# Altium project Capacitive_Touch_Sensor.PrjPcb
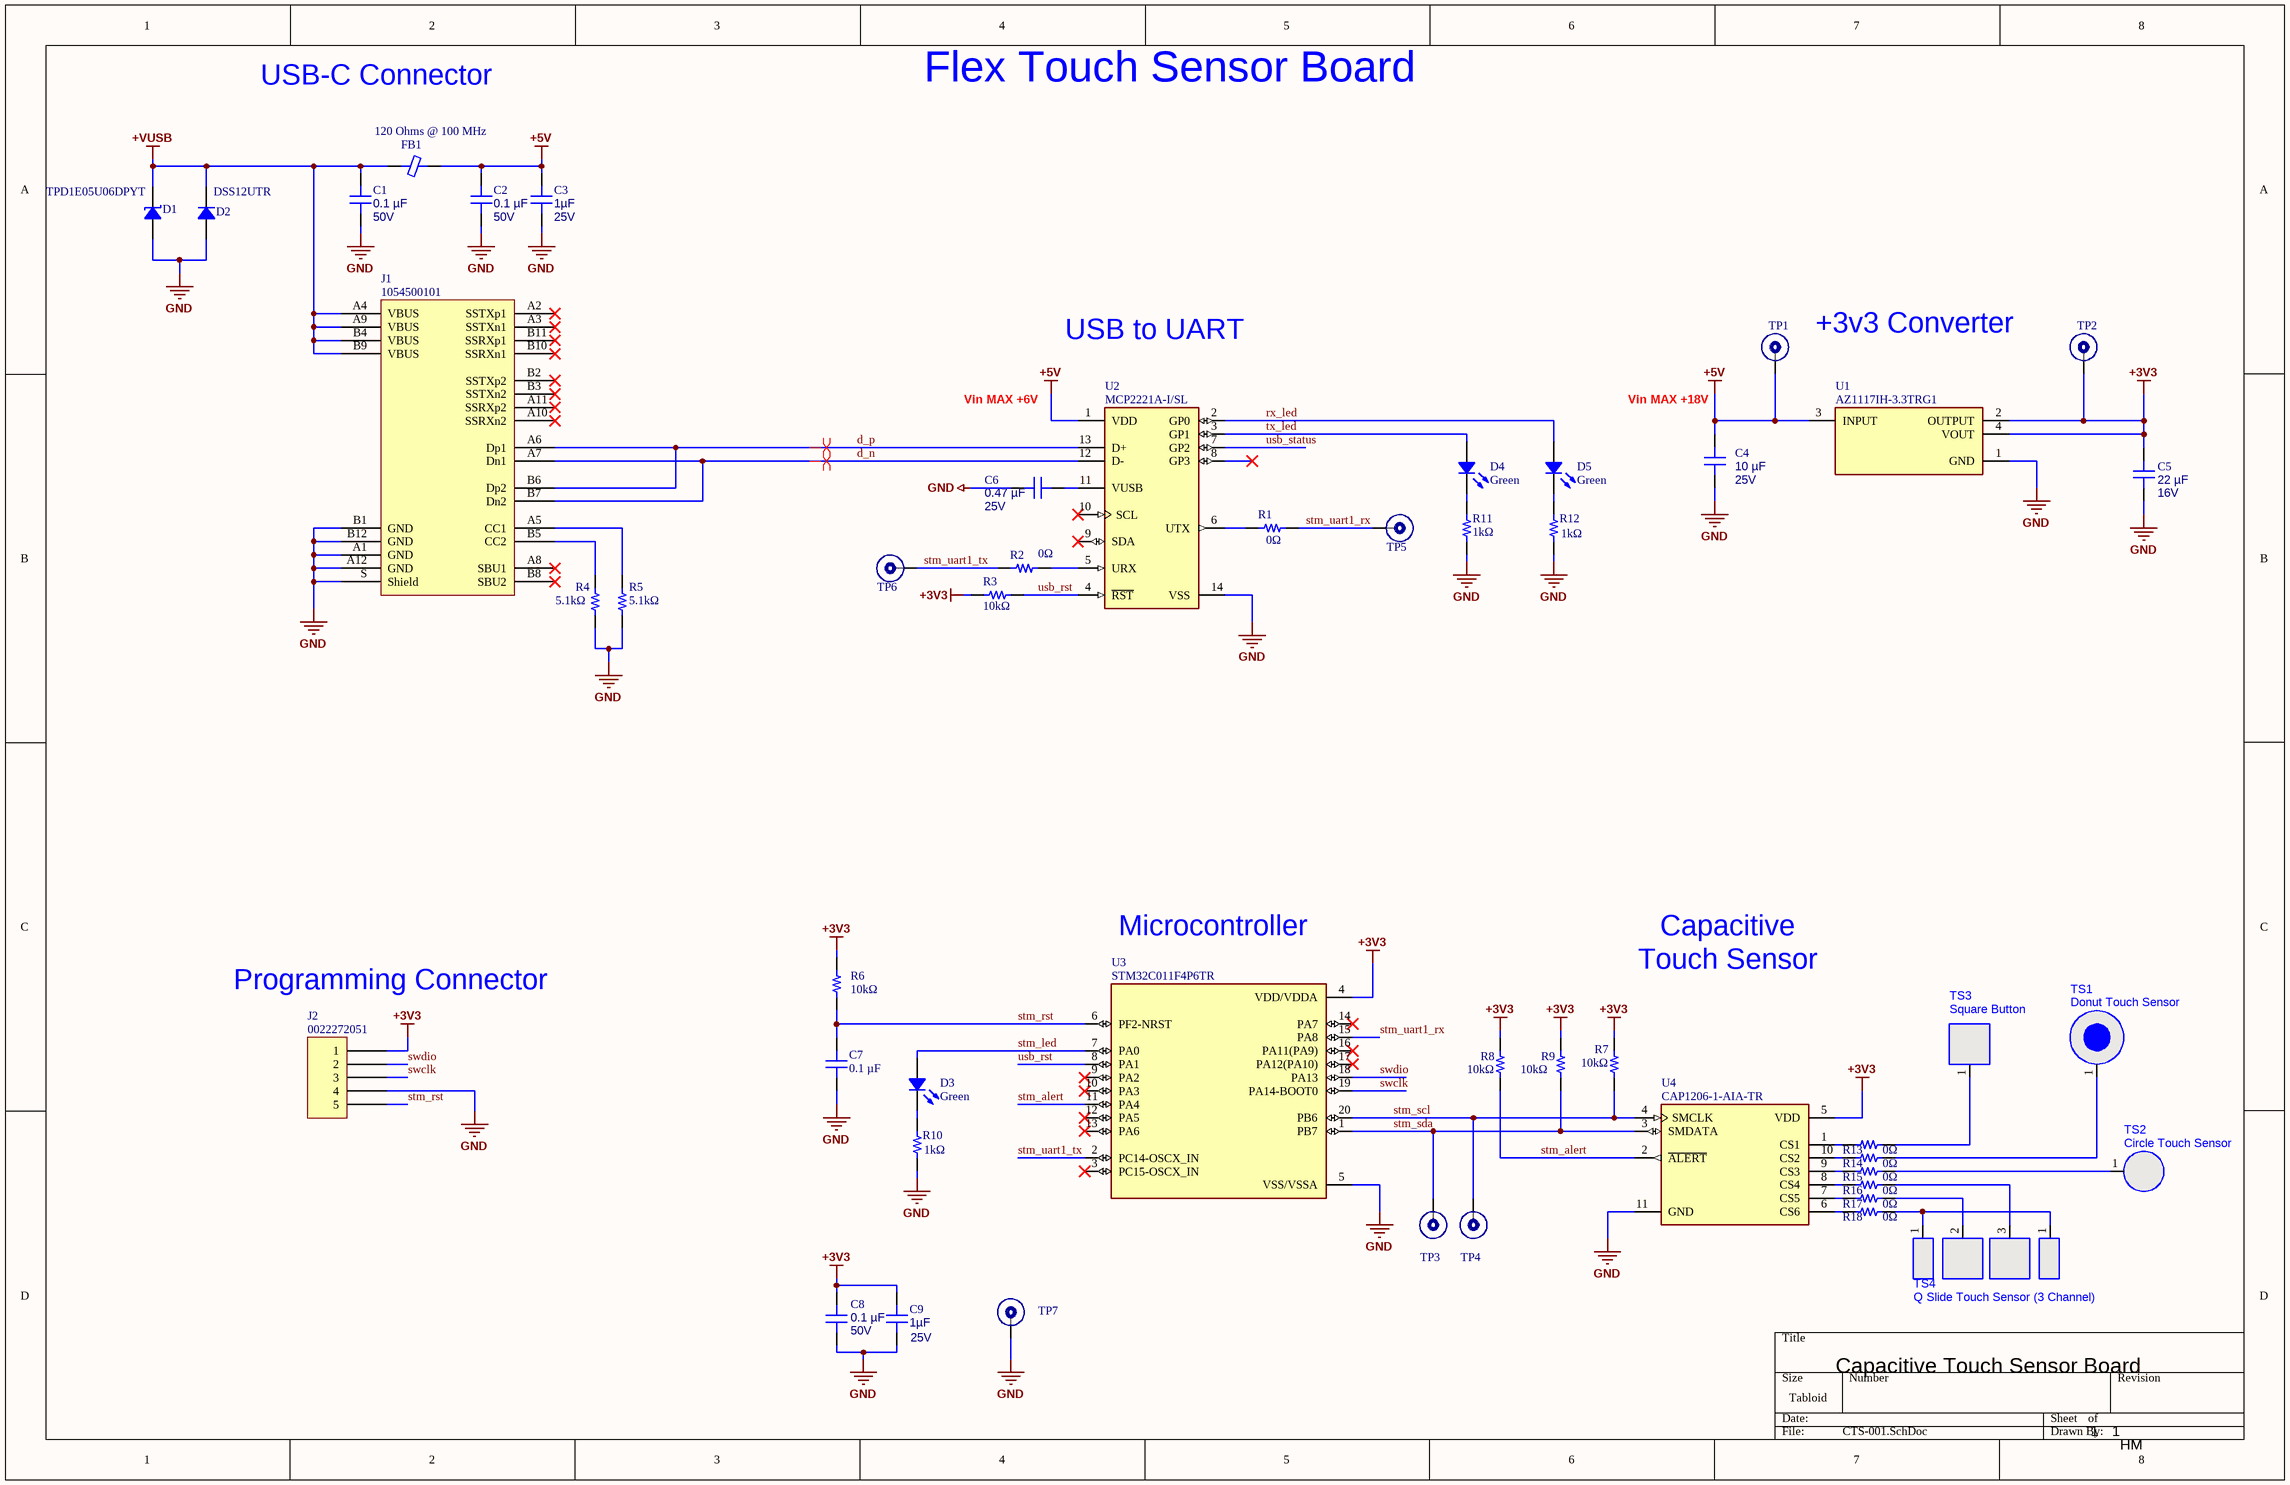
[diagram p0: CTS-001.SchDoc]
1 sheet, 50 parts. Net scope: global (net labels, ports and power ports of the same name join across sheets).
Board file: CTS.PcbDoc

## Sheet CTS-001.SchDoc
size Tabloid; SheetNumber: 1; SheetTotal: 1

### Parts
C1  Voltage - Rated: 50V  [CAP 0603_1608]  (hidden comment: 0.1 µF)
C2  Voltage - Rated: 50V  [CAP 0603_1608]  (hidden comment: 0.1 µF)
C3  Voltage - Rated: 25V  [CAP 0603_1608]  (hidden comment: 1µF)
C4  Voltage - Rated: 25V  [CAP 1206_3216 - 0.8MM]  (hidden comment: 10 µF)
C5  Voltage - Rated: 16V  [CAP 1206_3216 - 0.8MM]  (hidden comment: 22 µF)
C6  Voltage - Rated: 25V  [CAP 0603_1608]  (hidden comment: 0.47 µF)
C7  0.1 µF  [CAP 0603_1608]
C8  Voltage - Rated: 50V  [CAP 0603_1608]  (hidden comment: 0.1 µF)
C9  Voltage - Rated: 25V  [CAP 0603_1608]  (hidden comment: 1µF)
D1  TPD1E05U06DPYT  [0402]
D2  DSS12UTR  [SOD123F]
D3  Green  [LED 0603_1608 GREEN]
D4  Green  [LED 0603_1608 GREEN]
D5  Green  [LED 0603_1608 GREEN]
FB1  120 Ohms @ 100 MHz  [FER 0603_1608]
J1  1054500101  [Molex 1054500101]
J2  0022272051  [MOLEX KK 0022272051]
R1  0Ω  [RES 0805_2012]
R2  0Ω  [RES 0805_2012]
R3  10kΩ  [RES 0603_1608]
R4  5.1kΩ  [RES 0603_1608]
R5  5.1kΩ  [RES 0603_1608]
R6  10kΩ  [RES 0603_1608]
R7  10kΩ  [RES 0603_1608]
R8  10kΩ  [RES 0603_1608]
R9  10kΩ  [RES 0603_1608]
R10  1kΩ  [RES 0603_1608]
R11  1kΩ  [RES 0603_1608]
R12  1kΩ  [RES 0603_1608]
R13  0Ω  [RES 0805_2012]
R14  0Ω  [RES 0805_2012]
R15  0Ω  [RES 0805_2012]
R16  0Ω  [RES 0805_2012]
R17  0Ω  [RES 0805_2012]
R18  0Ω  [RES 0805_2012]
TP1  Test Point  [Compact]  (value not drawn)
TP2  Test Point  [Compact]  (value not drawn)
TP3  Test Point  [Compact]  (value not drawn)
TP4  Test Point  [Compact]  (value not drawn)
TP5  Test Point  [Compact]  (value not drawn)
TP6  Test Point  [Compact]  (value not drawn)
TP7  Test Point  [Compact]  (value not drawn)
TS1  Donut Touch Sensor  [DONUT TOUCH SENSOR]
TS2  Circle Touch Sensor  [CIRCLE TOUCH SENSOR]
TS3  Square Button  [Square Touch Sensor]
TS4  Q Slide Touch Sensor (3 Channel)  [Q TOUCH SLIDE SENSOR]
U1  AZ1117IH-3.3TRG1  [FP-SOT223-IPC_B]
U2  MCP2221A-I/SL  [FP-C04-065-SL-MFG]
U3  STM32C011F4P6TR  [SOP65P640X120-20N]
U4  CAP1206-1-AIA-TR  [FP-10DFN-162304-3x3B-MFG]

### Nets
+3V3: C5.2 C8.2 C9.2 J2.1 R3.2 R6.2 R7.2 R8.2 R9.2 TP2.1 U1.2(OUTPUT) U1.4(VOUT) U3.4(VDD/VDDA) U4.5(VDD)
+5V: C2.2 C3.2 C4.2 FB1.2 TP1.1 U1.3(INPUT) U2.1(VDD)
+VUSB: C1.2 D1.2 D2.2 FB1.1 J1.A4(VBUS) J1.A9(VBUS) J1.B4(VBUS) J1.B9(VBUS)
GND: C1.1 C2.1 C3.1 C4.1 C5.1 C6.1 C7.1 C8.1 C9.1 D1.1 D2.1 J1.A1(GND) J1.A12(GND) J1.B1(GND) J1.B12(GND) J1.S(Shield) J2.4 R4.1 R5.1 R10.1 R11.1 R12.1 TP7.1 U1.1(GND) U2.14(VSS) U3.5(VSS/VSSA) U4.11(GND)
d_n: J1.A7(Dn1) J1.B7(Dn2) U2.12(D-)
d_p: J1.A6(Dp1) J1.B6(Dp2) U2.13(D+)
rx_led: D5.1 U2.2(GP0)
stm_alert: R8.1 U3.11(PA4) U4.2(~{ALERT})
stm_led: D3.1 U3.7(PA0)
stm_rst: C7.2 J2.5 R6.1 U3.6(PF2-NRST)
stm_scl: R7.1 TP4.1 U3.20(PB6) U4.4(SMCLK)
stm_sda: R9.1 TP3.1 U3.1(PB7) U4.3(SMDATA)
stm_uart1_rx: R1.2 TP5.1 U3.15(PA8)
stm_uart1_tx: R2.1 TP6.1 U3.2(PC14-OSCX_IN)
swclk: J2.3 U3.19(PA14-BOOT0)
swdio: J2.2 U3.18(PA13)
tx_led: D4.1 U2.3(GP1)
usb_rst: R3.1 U2.4(~{RST}) U3.8(PA1)
usb_status: U2.7(GP2)
NetC6_2: C6.2 U2.11(VUSB)
NetD3_2: D3.2 R10.2
NetD4_2: D4.2 R11.2
NetD5_2: D5.2 R12.2
NetJ1_A5: J1.A5(CC1) R5.2
NetJ1_B5: J1.B5(CC2) R4.2
NetR1_1: R1.1 U2.6(UTX)
NetR2_2: R2.2 U2.5(URX)
NetR13_1: R13.1 U4.1(CS1)
NetR13_2: R13.2 TS3.1(NO)
NetR14_1: R14.1 U4.10(CS2)
NetR14_2: R14.2 TS1.1(NO)
NetR15_1: R15.1 U4.9(CS3)
NetR15_2: R15.2 TS2.1(NO)
NetR16_1: R16.1 U4.8(CS4)
NetR16_2: R16.2 TS4.3
NetR17_1: R17.1 U4.7(CS5)
NetR17_2: R17.2 TS4.2
NetR18_1: R18.1 U4.6(CS6)
NetR18_2: R18.2 TS4.1

Not connected (* = marked no-connect by the designer): J1 A2(SSTXp1)* A3(SSTXn1)* A8(SBU1)* A10(SSRXn2)* A11(SSRXp2)* B2(SSTXp2)* B3(SSTXn2)* B8(SBU2)* B10(SSRXn1)* B11(SSRXp1)*; U2 8(GP3)* 9(SDA)* 10(SCL)*; U3 3(PC15-OSCX_IN)* 9(PA2)* 10(PA3)* 12(PA5)* 13(PA6)* 14(PA7)* 16(PA11(PA9))* 17(PA12(PA10))*

### Layout directives
differential pair; rule Differential Pairs Routing [Pref Gap = 5mil    Min Gap  = 5mil    Max Gap  = 5milPref Width = 18.795mil    Min Width  = 18.795mil    Max Width  = 18.795mil]: d_n, d_p

### Notes on the sheet
- USB-C Connector
- Flex Touch Sensor Board
- USB to UART
- (near TP1) +3v3 Converter
- Vin MAX +6V
- (near C4) Vin MAX +18V
- Microcontroller
- Capacitive
- Touch Sensor
- Programming Connector
- Capacitive Touch Sensor Board
- 1
- HM

### Library data of the parts
C1 C2 C7 C8 = C0603C104K5RAC7411: CAP CER 0.1UF 50V X7R 0603; manufacturer: KEMET; Tolerance: ±10%; Part Number: C0603C104K5RAC7411; Capacitance: 0.1 µF; Applications: Bypass, Decoupling; componentlink1description: Datasheet; componentlink1url: https://api.kemet.com/component-edge/download/datasheet/C0603C104K5RAC7411.pdf; componentlink2description: DigiKey Link; componentlink2url: https://www.digikey.com/en/products/detail/kemet/C0603C104K5RAC7411/3317013; Device Package: 0603 (1608 Metric); lastupdated: 2026-04-06 7:23:52 PM; Lifecycle Status: Active; Minimum Order: 1; Mounting Type: Surface Mount, MLCC; Operating Temperature: -55°C ~ 125°C; Package / Case: 0603 (1608 Metric); packaging: TapeAndReel; partid: 2233; Part Status: Active; price: 0.01; series: SMD Comm X7R; Size / Dimension: 0.063" L x 0.031" W (1.60mm x 0.80mm); Supplier 1: DigiKey; Supplier Part Number 1: 399-C0603C104K5RAC7411CT-ND; Temperature Coefficient: X7R; Thickness (Max): 0.035" (0.90mm); value: 0.1 µF
  C7: Voltage - Rated: 50V
C3 C9 = 06033D105MAT2A: CAP CER 1UF 25V X5R 0603; manufacturer: AVX Corporation; Tolerance: ±20%; Part Number: 06033D105MAT2A; Capacitance: 1µF; Applications: General Purpose; componentlink1description: Datasheet; componentlink1url: http://datasheets.avx.com/cx5r.pdf; componentlink2description: DigiKey Link; componentlink2url: http://digikey.com/product-detail/en/avx-corporation/06033D105MAT2A/478-4531-1-ND/1645882; Device Package: 0603 (1608 Metric); lastupdated: 2020-09-02 1:03:35 AM; Lifecycle Status: Active; Minimum Order: 1; Mounting Type: Surface Mount, MLCC; Operating Temperature: -55°C ~ 85°C; Package / Case: 0603 (1608 Metric); packaging: TapeAndReel; partid: 2656; Part Status: Active; price: 0.11; series: -; Size / Dimension: 0.063" L x 0.032" W (1.60mm x 0.81mm); Supplier 1: DigiKey; Supplier Part Number 1: 478-4531-1-ND; Temperature Coefficient: X5R; Thickness (Max): 0.035" (0.90mm); value: 1µF
C4 = GRM31CR71E106KA12K: CAP CER 10UF 25V X7R 1206; manufacturer: Murata Electronics; Tolerance: ±10%; Part Number: GRM31CR71E106KA12K; Capacitance: 10 µF; Applications: General Purpose; componentlink1description: Datasheet; componentlink1url: https://search.murata.co.jp/Ceramy/image/img/A01X/G101/ENG/GRM31CR71E106KA12-01.pdf; componentlink2description: DigiKey Link; componentlink2url: https://www.digikey.com/en/products/detail/murata-electronics/GRM31CR71E106KA12K/4905618; Device Package: 1206 (3216 Metric); lastupdated: 2026-04-06 7:38:01 PM; Lifecycle Status: Active; Minimum Order: 1; Mounting Type: Surface Mount, MLCC; Operating Temperature: -55°C ~ 125°C; Package / Case: 1206 (3216 Metric); packaging: TapeAndReel; partid: 19493; Part Status: Active; price: 0.07; series: GRM; Size / Dimension: 0.126" L x 0.063" W (3.20mm x 1.60mm); Supplier 1: DigiKey; Supplier Part Number 1: 490-14678-1-ND; Temperature Coefficient: X7R; Thickness (Max): 0.071" (1.80mm); value: 10 µF
C5 = CL31A226KOCLFNC: CAP CER 22UF 16V X5R 1206; manufacturer: Samsung Electro-Mechanics; Tolerance: ±10%; Part Number: CL31A226KOCLFNC; Capacitance: 22 µF; Applications: General Purpose; componentlink1description: Datasheet; componentlink1url: http://www.samsungsem.com/kr/support/product-search/mlcc/CL31A226KOCLFNC.jsp; componentlink2description: DigiKey Link; componentlink2url: https://www.digikey.com/en/products/detail/samsung-electro-mechanics/CL31A226KOCLFNC/3888383; Device Package: 1206 (3216 Metric); lastupdated: 2026-04-06 7:38:00 PM; Lifecycle Status: Active; Minimum Order: 1; Mounting Type: Surface Mount, MLCC; Operating Temperature: -55°C ~ 85°C; Package / Case: 1206 (3216 Metric); packaging: TapeAndReel; partid: 18940; Part Status: Active; price: 0.09; series: CL; Size / Dimension: 0.126" L x 0.063" W (3.20mm x 1.60mm); Supplier 1: DigiKey; Supplier Part Number 1: 1276-2725-1-ND; Temperature Coefficient: X5R; Thickness (Max): 0.037" (0.95mm); value: 22 µF
C6 = GMC10X7R474J25NT: CAP0603 X7R .47UF 5% 25V; manufacturer: Cal-Chip Electronics, Inc.; Part Number: GMC10X7R474J25NT; Capacitance: 0.47 µF; Applications: General Purpose; componentlink1description: Datasheet; componentlink1url: https://calchip.com/wp-content/uploads/2024/02/gmc_series-1.pdf; componentlink2description: DigiKey Link; componentlink2url: https://www.digikey.com/en/products/detail/cal-chip-electronics-inc/GMC10X7R474J25NT/25573329; Device Package: 0603 (1608 Metric); lastupdated: 2026-04-06 7:17:50 PM; Lifecycle Status: Active; Minimum Order: 1; Mounting Type: Surface Mount, MLCC; Operating Temperature: -55°C ~ 125°C; Package / Case: 0603 (1608 Metric); packaging: TapeAndReel; partid: 65729; price: 0.02; series: GMC; Size / Dimension: 0.063" L x 0.031" W (1.60mm x 0.80mm); Supplier 1: DigiKey; Supplier Part Number 1: 4713-GMC10X7R474J25NTCT-ND; Temperature Coefficient: X7R; Thickness (Max): 0.037" (0.95mm); Tolerance: ±5%; value: 0.47 µF
D1 = TPD1E05U06DPYT: TVS DIODE 5.5VWM 14VC 2X1SON; Manufacturer: Texas Instruments; Current - Peak Pulse (10/1000µs): 2.5A (8/20µs); Power Line Protection: Yes; Power - Peak Pulse: 40W; Type: Zener; Unidirectional Channels: 1; Voltage - Breakdown (Min): 6.5V; Voltage - Clamping (Max) @ Ipp: 14V; Voltage - Reverse Standoff (Typ): 5.5V (Max); Part Number: TPD1E05U06DPYT; Applications: HDMI; ComponentLink1Description: Datasheet; ComponentLink1URL: http://www.ti.com/general/docs/suppproductinfo.tsp?distId=10&gotoUrl=http%3A%2F%2Fwww.ti.com%2Flit%2Fgpn%2Ftpd1e05u06; ComponentLink2Description: DigiKey Link; ComponentLink2URL: https://www.digikey.com/en/products/detail/texas-instruments/TPD1E05U06DPYT/3902056; Device Package: 0402 (1005 Metric); LastUpdated: 2026-04-05 9:01:42 PM; Lifecycle Status: Active; Minimum Order: 1; Mounting Type: Surface Mount; Operating Temperature: -40°C ~ 125°C (TA); Package / Case: 0402 (1005 Metric); Packaging: TapeAndReel; PartId: 10366; Part Status: Active; Price: 0.32; Series: -; Supplier 1: DigiKey; Supplier Part Number 1: 296-39342-1-ND; Supplier Device Package: 2-X1SON (1x.60)
D2 = DSS12UTR: SCHOTTKY 20V SOD-123FL; Manufacturer: SMC Diode Solutions; Capacitance @ Vr, F: 110pF @ 4V, 1MHz; Current - Average Rectified (Io): 1A; Current - Reverse Leakage @ Vr: 100 µA @ 20 V; Speed: Fast Recovery =< 500ns, > 200mA (Io); Voltage - Forward (Vf) (Max) @ If: 500 mV @ 1 A; Part Number: DSS12UTR; ComponentLink1Description: Datasheet; ComponentLink1URL: http://www.smc-diodes.com/propdf/DSS12U%20THRU%20DSS125U%20N1873%20REV.A.pdf; ComponentLink2Description: DigiKey Link; ComponentLink2URL: https://www.digikey.com/en/products/detail/smc-diode-solutions/DSS12UTR/8341857; Diode Type: Schottky; LastUpdated: 2026-04-05 8:31:53 PM; Lifecycle Status: Active; Minimum Order: 1; Mounting Type: Surface Mount; Operating Temperature - Junction: -55°C ~ 150°C; Package / Case: SOD-123F; Packaging: TapeAndReel; PartId: 2514; Part Status: Active; Price: 0.03; Series: -; Supplier 1: DigiKey; Supplier Part Number 1: 1655-1925-1-ND; Supplier Device Package: SOD-123FL; Voltage - DC Reverse (Vr) (Max): 20 V
D3-D5 = VLMTG1400-GS08: LED GREEN 0603 SMD; Manufacturer: Vishay Semiconductor Opto Division; Configuration: Standard; Current - Test: 20mA; Lens Color: 0.65mm; Lens Size: 1.10mm x 0.80mm; Lens Style: Rectangle with Flat Top; Millicandela Rating: 1400mcd; Viewing Angle: 146°; Voltage - Forward (Vf) (Typ): 2.85V; Wavelength - Dominant: 525nm; Wavelength - Peak: 518nm; Part Number: VLMTG1400-GS08; Color: Green; ComponentLink1Description: Datasheet; ComponentLink1URL: http://www.vishay.com/docs/84393/vlmtg1400.pdf; ComponentLink2Description: DigiKey Link; ComponentLink2URL: https://www.digikey.com/en/products/detail/vishay-semiconductor-opto-division/VLMTG1400-GS08/7597661; Device Package: 0603 (1608 Metric); Height (Max): 0.65mm; LastUpdated: 2026-04-05 8:36:38 PM; Lifecycle Status: Active; Minimum Order: 1; Mounting Type: Surface Mount; Package / Case: 0603 (1608 Metric); Packaging: TapeAndReel; PartId: 606; Part Status: Active; Price: 0.10; Series: CHIPLED; Size / Dimension: 1.60mm L x 0.80mm W; Supplier 1: DigiKey; Supplier Part Number 1: VLMTG1400-GS08CT-ND; Supplier Device Package: 0603; Value: Green
FB1 = BLM18BD121BH1D: FERRITE BEAD 120 OHM 0603 1LN; Manufacturer: Murata Electronics; Current Rating (Max): 300mA; DC Resistance (DCR) (Max): 400mOhm; Filter Type: Power Line; Number of Lines: 1; Part Number: BLM18BD121BH1D; ComponentLink1Description: Datasheet; ComponentLink1URL: https://www.murata.com/en-us/products/productdata/8798137286686/QNFA9129.pdf; ComponentLink2Description: DigiKey Link; ComponentLink2URL: https://www.digikey.com/en/products/detail/murata-electronics/BLM18BD121BH1D/6156012; Device Package: 0603 (1608 Metric); Height (Max): 0.037" (0.95mm); Impedance @ Frequency: 120 Ohms @ 100 MHz; LastUpdated: 2026-04-05 8:28:12 PM; Lifecycle Status: Active; Minimum Order: 1; Mounting Type: Surface Mount; Operating Temperature: -55°C ~ 150°C; Package / Case: 0603 (1608 Metric); Packaging: TapeAndReel; PartId: 562; Part Status: Active; Price: 0.03; Ratings: AEC-Q200; Series: EMIFIL®, BLM18; Size / Dimension: 0.063" L x 0.031" W (1.60mm x 0.80mm); Supplier 1: DigiKey; Supplier Part Number 1: 490-14041-1-ND; Value: 120 Ohms @ 100 MHz
J1 = 1054500101: CONN RCP USB3.1 TYPEC 24P SMD RA; Manufacturer: Molex; Connector Type: USB - C (Type - C); Current Rating (Amps): 0.25A, 1A, 5A; Gender: Receptacle; Mating Cycles: 10000; Number of Contacts: 24; Number of Ports: 1; Shielding: Shielded; Specifications: USB 3.1 (USB 3.1 Gen 2, Superspeed+); Voltage - Rated: 30VAC/DC; Part Number: 1054500101; ComponentLink1Description: Datasheet; ComponentLink1URL: https://www.molex.com/pdm_docs/ps/PS-105448-001.pdf; ComponentLink2Description: DigiKey Link; ComponentLink2URL: http://digikey.com/product-detail/en/molex/1054500101/WM12856CT-ND/5843891; LastUpdated: 2020-06-06 2:14:04 AM; Lifecycle Status: Active; Minimum Order: 1; Mounting Feature: Horizontal; Mounting Type: Surface Mount, Right Angle; Through Hole; Operating Temperature: -30°C ~ 85°C; Packaging: TapeAndReel; Part Status: Active; Price: 1.22; Series: 105445; Supplier 1: DigiKey; Supplier Part Number 1: WM12856CT-ND; Termination: Solder
J2 = 0022272051: CONN HEADER VERT 5POS 2.54MM; Manufacturer: Molex; Contact Length - Mating: 0.295" (7.49mm); Contact Length - Post: 0.140" (3.56mm); Material Flammability Rating: UL94 V-0; Number of Positions: 5; Number of Positions Loaded: All; Overall Contact Length: 0.560" (14.22mm); Pitch - Mating: 0.100" (2.54mm); Shrouding: Shrouded - 1 Wall; Style: Board to Cable/Wire; Part Number: 0022272051; ComponentLink1Description: Datasheet; ComponentLink1URL: https://www.molex.com/pdm_docs/sd/022272051_sd.pdf; ComponentLink2Description: DigiKey Link; ComponentLink2URL: http://digikey.com/product-detail/en/molex/0022272051/WM4114-ND/1130580; Connector Type: Header; Contact Finish - Mating: Tin; Contact Finish - Post: Tin; Contact Finish Thickness - Mating: 100.0µin (2.54µm); Contact Material: Brass; Contact Shape: Square; Contact Type: Male Pin; Fastening Type: Friction Lock; Insulation Color: Natural; Insulation Height: 0.461" (11.70mm); Insulation Material: Polyamide (PA), Nylon; LastUpdated: 2020-01-12 11:52:16 PM; Lifecycle Status: Active; Minimum Order: 1; Mounting Type: Through Hole; Number of Rows: 1; Packaging: Bulk; PartId: 79; Part Status: Active; Price: 0.46; Series: KK 6410; Supplier 1: DigiKey; Supplier Part Number 1: WM4114-ND; Termination: Solder
R1 R2 R13-R18 = TLRZ2ATTD: RES 0 OHM JUMPER 0805; Manufacturer: KOA Speer Electronics, Inc.; Value: 0 Ohms; Part Number: TLRZ2ATTD; ComponentLink1Description: Datasheet; ComponentLink1URL: http://www.koaspeer.com/catimages/Products/TLRZ/TLRZ.pdf; ComponentLink2Description: DigiKey Link; ComponentLink2URL: https://www.digikey.com/en/products/detail/koa-speer-electronics-inc/TLRZ2ATTD/9845494; Composition: Metal Element; Device Package: 0805 (2012 Metric); Features: Automotive AEC-Q200, Current Sense; Height - Seated (Max): 0.022" (0.55mm); LastUpdated: 2026-04-05 8:11:26 PM; Lifecycle Status: Active; Minimum Order: 1; Number of Terminations: 2; Operating Temperature: -65°C ~ 170°C; Package / Case: 0805 (2012 Metric); Packaging: TapeAndReel; PartId: 27685; Part Status: Active; Price: 0.08; Ratings: AEC-Q200; Resistance: 0 Ohms; Series: TLRZ; Size / Dimension: 0.079" L x 0.049" W (2.00mm x 1.25mm); Supplier 1: DigiKey; Supplier Part Number 1: 2019-TLRZ2ATTDCT-ND; Supplier Device Package: 0805; Tolerance: Jumper
R3 R6-R9 = CPF0603B10KE: RES SMD 10K OHM 0.1% 1/16W 0603; Manufacturer: TE Connectivity Passive Product; Value: 10 kOhms; Power (Watts): 0.063W, 1/16W; Temperature Coefficient: ±25ppm/°C; Part Number: CPF0603B10KE; ComponentLink1Description: Datasheet; ComponentLink1URL: https://www.te.com/commerce/DocumentDelivery/DDEController?Action=srchrtrv&DocNm=1773200&DocType=DS&DocLang=English; ComponentLink2Description: DigiKey Link; ComponentLink2URL: https://www.digikey.com/en/products/detail/te-connectivity-passive-product/CPF0603B10KE/2389826; Composition: Thin Film; Device Package: 0603 (1608 Metric); Height - Seated (Max): 0.022" (0.55mm); LastUpdated: 2024-02-09 8:43:37 PM; Lifecycle Status: Active; Minimum Order: 1; Number of Terminations: 2; Operating Temperature: -55°C ~ 155°C; Package / Case: 0603 (1608 Metric); Packaging: TapeAndReel; PartId: 4872; Part Status: Active; Price: 0.09; Resistance: 10 kOhms; Series: CPF, Neohm; Size / Dimension: 0.061" L x 0.031" W (1.55mm x 0.80mm); Supplier 1: DigiKey; Supplier Part Number 1: A119886CT-ND; Supplier Device Package: 0603; Tolerance: ±0.1%
R4 R5 = RMCF0603FT5R10: RES 5.1 OHM 1% 1/10W 0603; Manufacturer: Stackpole Electronics Inc; Value: 5.1 Ohms; Power (Watts): 0.1W, 1/10W; Temperature Coefficient: ±200ppm/°C; Part Number: RMCF0603FT5R10; ComponentLink1Description: Datasheet; ComponentLink1URL: https://www.seielect.com/catalog/sei-rmcf_rmcp.pdf; ComponentLink2Description: DigiKey Link; ComponentLink2URL: https://www.digikey.com/en/products/detail/stackpole-electronics-inc/RMCF0603FT5R10/1761181; Composition: Thick Film; Device Package: 0603 (1608 Metric); Features: Automotive AEC-Q200; Height - Seated (Max): 0.022" (0.55mm); LastUpdated: 2024-02-09 8:43:31 PM; Lifecycle Status: Active; Minimum Order: 1; Number of Terminations: 2; Operating Temperature: -55°C ~ 155°C; Package / Case: 0603 (1608 Metric); Packaging: CutTape; PartId: 6203; Part Status: Active; Price: 0.01; Ratings: AEC-Q200; Resistance: 5.1 Ohms; Series: RMCF; Size / Dimension: 0.061" L x 0.031" W (1.55mm x 0.80mm); Supplier 1: DigiKey; Supplier Part Number 1: RMCF0603FT5R10CT-ND; Supplier Device Package: 0603; Tolerance: ±1%
R10-R12 = CRCW06031K00FKEB: RES SMD 1K OHM 1% 1/10W 0603; Manufacturer: Vishay Dale; Value: 1 kOhms; Power (Watts): 0.1W, 1/10W; Temperature Coefficient: ±100ppm/°C; Part Number: CRCW06031K00FKEB; ComponentLink1Description: Datasheet; ComponentLink1URL: http://www.vishay.com/docs/20035/dcrcwe3.pdf; ComponentLink2Description: DigiKey Link; ComponentLink2URL: https://www.digikey.com/en/products/detail/vishay-dale/CRCW06031K00FKEB/5071169; Composition: Thick Film; Device Package: 0603 (1608 Metric); Features: Automotive AEC-Q200; Height - Seated (Max): 0.020" (0.50mm); LastUpdated: 2024-02-09 8:43:36 PM; Lifecycle Status: Active; Minimum Order: 1; Number of Terminations: 2; Operating Temperature: -55°C ~ 155°C; Package / Case: 0603 (1608 Metric); Packaging: CutTape; PartId: 5123; Part Status: Active; Price: 0.01; Ratings: AEC-Q200; Resistance: 1 kOhms; Series: CRCW; Size / Dimension: 0.063" L x 0.033" W (1.60mm x 0.85mm); Supplier 1: DigiKey; Supplier Part Number 1: 541-2985-1-ND; Supplier Device Package: 0603; Tolerance: ±1%
TP1-TP7 = TP SMT Compact: Test-Point SMT Compact; BTI Part #: 113190062; Manufacturer Part #: 5016; Install/No Install: Install
TS1 = donut_button
TS2 = circle_button
TS3 = square_button
TS4 = q_touch_slider
U1 = CMP-12756-000043-1: IC REG LINEAR 3.3V 1A SOT223; Output Current: 800mA; Number of Regulators: 1; Dropout Voltage: 1.2V; RoHS Compliant: Yes; Min Current Limit: 1A; Mount: Surface Mount; Packaging: Tape and Reel; Output Voltage: 3.3V; Min Operating Temperature: -40°C; Max Operating Temperature: 125°C; Number of Pins: 3; Case/Package: TO-261-4
U2 = CMP-06284-000011-1: IC USB TO I2C/UART 14SOIC; Manufacturer: Microchip; Min Supply Voltage: 3V; Usb Standard: USB 2.0; Max Supply Voltage: 5.5V; Nominal Supply Current: 10-13mA; Automotive Grade: Grade 3; Interface: I2C,UART,USB; Standoff Height: 0.1mm; Max Junction Temp: +150°C; Data Rate: 12Mbits/s; Lead Free: Yes; Height: 1.75mm; Octopart: https://octopart.com/mcp2221a-i%2Fsl-microchip-71704986; Package: C04-065-SL; Digikey Description: IC USB TO I2C/UART 14SOIC; Temperature Range Low: -40°C; Temperature: -40°C to +85°C; Category: IC; Temperature Range High: +85°C; Ambient Temperature Range Low: -40°C; Device Class L1: Integrated Circuits (ICs); Footprint Url: http://ww1.microchip.com/downloads/en/DeviceDoc/14L%20SOIC%203_90%20mm%20%28SL%29%20C04-00065d.pdf; Automotive: Yes; ComponentLink2URL: http://ww1.microchip.com/downloads/en/DeviceDoc/20005565B.pdf; Ambient Temperature Range High: +85°C; RoHS: TRUE; Device Class L3: USB Interface ICs; ComponentLink2Description: Datasheet; Device Class L2: Interface ICs; Manufacturer Part Number: MCP2221A-I/SL; Ipc Land Pattern Name: SOIC127P600X175-14
U3 = STM32C011F4P6TR: ARMÂ® CortexÂ®-M0+ STM32C0 Microcontroller IC 32-Bit 48MHz 16KB (16K x 8) FLASH 20-TSSOP; MF: STMicroelectronics; SnapEDA_Link: https://www.snapeda.com/parts/STM32C011F4P6TR/STMicroelectronics/view-part/?ref=snap; Package: None; Value: *; MP: STM32C011F4P6TR; Check_prices: https://www.snapeda.com/parts/STM32C011F4P6TR/STMicroelectronics/view-part/?ref=eda
U4 = CMP-06270-000017-1: IC TOUCH SENSOR CAP 6CH 10DFN; Min Supply Voltage: 3V; Operating Supply Voltage: 5V; Nominal Supply Current: 500uA; Max Supply Voltage: 5.5V; Interface: I2C; Number of Inputs: 6; Touchscreen: Capacitive; Width: 3mm; Mount: Surface Mount; Case/Package: DFN; Number of Pins: 10; Package Quantity: 5000; Supply Current: 500uA; Max Operating Temperature: 125°C; Packaging: Tape and Reel; Length: 3mm; Operating Supply Current: 500uA; Min Operating Temperature: -40°C; RoHS Compliant: Yes; Number of Channels: 6; Reach SVHC Compliant: Yes; Series: -; Termination: SMD/SMT